# Altium schematic sheet Antena.SchDoc
size A4
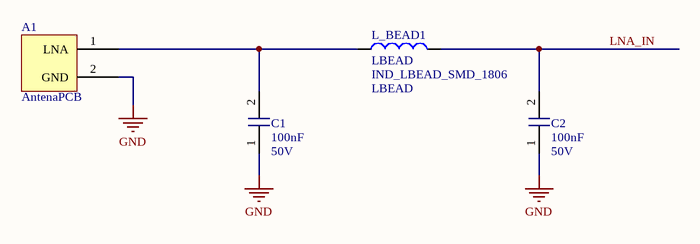
[diagram p0: Antena.SchDoc]

## Parts
A1  AntenaPCB  [PCBComponent_1]
C1  Capacitance: 100nF  Voltage: 50V  [CAP 100nF/50V]  (hidden comment: CAP 100nF/50V)
C2  Capacitance: 100nF  Voltage: 50V  [CAP 100nF/50V]  (hidden comment: CAP 100nF/50V)
L_BEAD1  LBEAD  [IND_LBEAD_SMD_1806]

## Nets
GND: A1.2(GND) C1.1 C2.1
LNA_IN: C2.2 L_BEAD1.2
NetA1_1: A1.1(LNA) C1.2 L_BEAD1.1

## Library data of the parts
C1 C2 = CAP 100nF/50V: 0.1µF ±10% 50V Ceramic Capacitor X5R 0402 (1005 Metric); Manufacturer 1: Yageo; Manufacturer 1 PN: CC0402KRX5R9BB104; Digikey PN: 311-3342-1-ND; ComponentLink1Description: Datasheet; ComponentLink1URL: https://search.murata.co.jp/Ceramy/image/img/A01X/G101/ENG/GRM022R60J103KE19-01.pdf
L_BEAD1 = IND_LBEAD_SMD_1806: Inductor LBEAD; Value: LBEAD